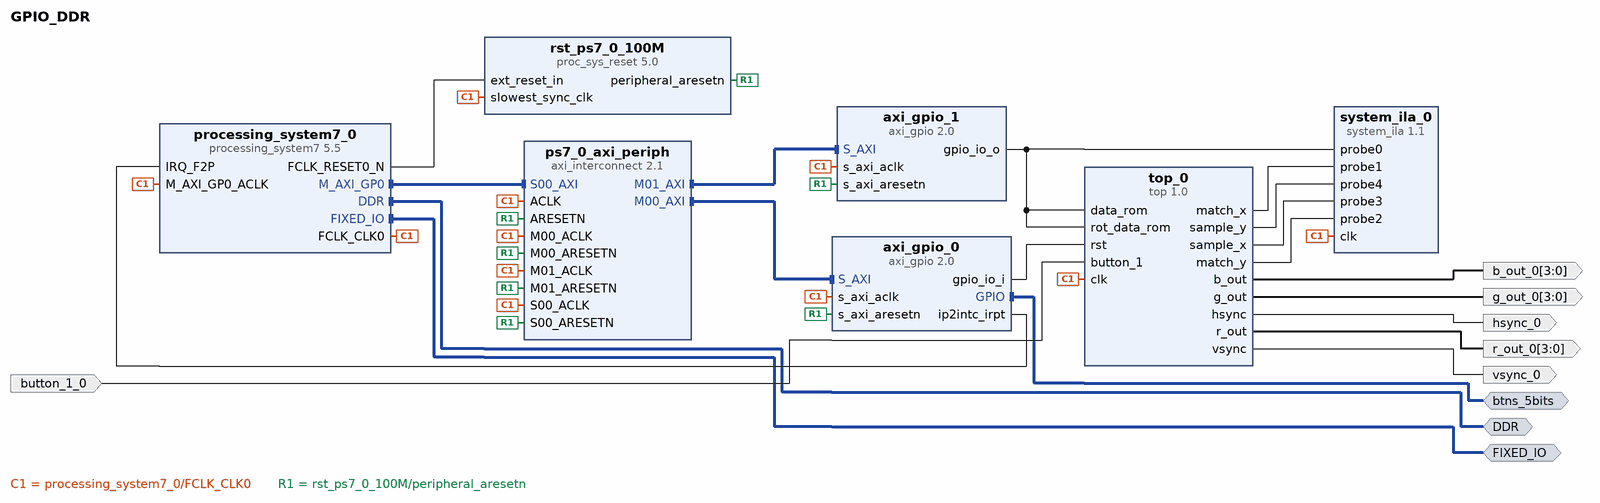
[diagram p0: block diagram of the top level]
# Vivado block design GPIO_DDR, xc7z020clg484-1, Vivado 2020.2
create_bd_design GPIO_DDR

create_bd_intf_port -mode Master -vlnv xilinx.com:interface:ddrx_rtl:1.0 DDR
create_bd_intf_port -mode Master -vlnv xilinx.com:display_processing_system7:fixedio_rtl:1.0 FIXED_IO
create_bd_intf_port -mode Master -vlnv xilinx.com:interface:gpio_rtl:1.0 btns_5bits
create_bd_port -dir I button_1_0
create_bd_port -dir O -from 3 -to 0 b_out_0
create_bd_port -dir O -from 3 -to 0 g_out_0
create_bd_port -dir O hsync_0
create_bd_port -dir O -from 3 -to 0 r_out_0
create_bd_port -dir O vsync_0

create_bd_cell -type ip -vlnv xilinx.com:ip:processing_system7:5.5 processing_system7_0
set_property -dict [list \
  CONFIG.PCW_APU_PERIPHERAL_FREQMHZ 666.666667 \
  CONFIG.PCW_ENET0_PERIPHERAL_ENABLE 0 \
  CONFIG.PCW_FPGA0_PERIPHERAL_FREQMHZ 100.000000 \
  CONFIG.PCW_FPGA1_PERIPHERAL_FREQMHZ 150.000000 \
  CONFIG.PCW_GPIO_MIO_GPIO_ENABLE 0 \
  CONFIG.PCW_IRQ_F2P_INTR 1 \
  CONFIG.PCW_PRESET_BANK1_VOLTAGE {LVCMOS 1.8V} \
  CONFIG.PCW_QSPI_PERIPHERAL_ENABLE 0 \
  CONFIG.PCW_SD0_GRP_CD_ENABLE 1 \
  CONFIG.PCW_SD0_GRP_CD_IO {MIO 47} \
  CONFIG.PCW_SD0_GRP_WP_ENABLE 1 \
  CONFIG.PCW_SD0_GRP_WP_IO {MIO 46} \
  CONFIG.PCW_SD0_PERIPHERAL_ENABLE 1 \
  CONFIG.PCW_SD0_SD0_IO {MIO 40 .. 45} \
  CONFIG.PCW_SDIO_PERIPHERAL_FREQMHZ 50 \
  CONFIG.PCW_UART1_PERIPHERAL_ENABLE 1 \
  CONFIG.PCW_UART1_UART1_IO {MIO 48 .. 49} \
  CONFIG.PCW_UART_PERIPHERAL_FREQMHZ 50 \
  CONFIG.PCW_UIPARAM_DDR_FREQ_MHZ 533.333313 \
  CONFIG.PCW_UIPARAM_DDR_PARTNO {MT41J128M16 HA-15E} \
  CONFIG.PCW_USB0_PERIPHERAL_ENABLE 0 \
  CONFIG.PCW_USE_FABRIC_INTERRUPT 1 \
  CONFIG.preset ZedBoard \
] [get_bd_cells processing_system7_0]
# 97 more settings of processing_system7_0 are not shown: defaults, MIO pin electricals, DDR timing, and values the tool derives
create_bd_cell -type ip -vlnv xilinx.com:ip:axi_gpio:2.0 axi_gpio_0
set_property -dict [list \
  CONFIG.C_GPIO_WIDTH 5 \
  CONFIG.C_INTERRUPT_PRESENT 1 \
  CONFIG.GPIO_BOARD_INTERFACE Custom \
  CONFIG.USE_BOARD_FLOW true \
] [get_bd_cells axi_gpio_0]
create_bd_cell -type ip -vlnv xilinx.com:ip:axi_interconnect:2.1 ps7_0_axi_periph
set_property -dict {CONFIG.NUM_MI 2} [get_bd_cells ps7_0_axi_periph]
create_bd_cell -type ip -vlnv xilinx.com:ip:proc_sys_reset:5.0 rst_ps7_0_100M
create_bd_cell -type ip -vlnv xilinx.com:ip:axi_gpio:2.0 axi_gpio_1
set_property -dict [list \
  CONFIG.C_ALL_OUTPUTS 1 \
  CONFIG.C_GPIO_WIDTH 8 \
  CONFIG.GPIO_BOARD_INTERFACE Custom \
  CONFIG.USE_BOARD_FLOW true \
] [get_bd_cells axi_gpio_1]
create_bd_cell -type ip -vlnv xilinx.com:user:top:1.0 top_0
create_bd_cell -type ip -vlnv xilinx.com:ip:system_ila:1.1 system_ila_0
set_property -dict [list \
  CONFIG.C_MON_TYPE NATIVE \
  CONFIG.C_NUM_OF_PROBES 5 \
  CONFIG.C_PROBE0_TYPE 0 \
  CONFIG.C_PROBE1_TYPE 0 \
  CONFIG.C_PROBE2_TYPE 0 \
  CONFIG.C_PROBE3_TYPE 0 \
  CONFIG.C_PROBE4_TYPE 0 \
] [get_bd_cells system_ila_0]

# ---- connections ----

connect_bd_intf_net [get_bd_intf_ports DDR] [get_bd_intf_pins processing_system7_0/DDR]
connect_bd_intf_net [get_bd_intf_ports btns_5bits] [get_bd_intf_pins axi_gpio_0/GPIO]
connect_bd_intf_net [get_bd_intf_pins processing_system7_0/M_AXI_GP0] [get_bd_intf_pins ps7_0_axi_periph/S00_AXI]
connect_bd_intf_net [get_bd_intf_pins ps7_0_axi_periph/M01_AXI] [get_bd_intf_pins axi_gpio_1/S_AXI]
connect_bd_intf_net [get_bd_intf_pins ps7_0_axi_periph/M00_AXI] [get_bd_intf_pins axi_gpio_0/S_AXI]
connect_bd_intf_net [get_bd_intf_ports FIXED_IO] [get_bd_intf_pins processing_system7_0/FIXED_IO]
connect_bd_net [get_bd_pins processing_system7_0/FCLK_CLK0] \
  [get_bd_pins processing_system7_0/M_AXI_GP0_ACLK] [get_bd_pins ps7_0_axi_periph/S00_ACLK] \
  [get_bd_pins rst_ps7_0_100M/slowest_sync_clk] [get_bd_pins axi_gpio_0/s_axi_aclk] [get_bd_pins ps7_0_axi_periph/M00_ACLK] \
  [get_bd_pins ps7_0_axi_periph/ACLK] [get_bd_pins axi_gpio_1/s_axi_aclk] [get_bd_pins ps7_0_axi_periph/M01_ACLK] \
  [get_bd_pins top_0/clk] [get_bd_pins system_ila_0/clk]
connect_bd_net [get_bd_pins processing_system7_0/FCLK_RESET0_N] [get_bd_pins rst_ps7_0_100M/ext_reset_in]
connect_bd_net [get_bd_pins rst_ps7_0_100M/peripheral_aresetn] \
  [get_bd_pins ps7_0_axi_periph/S00_ARESETN] [get_bd_pins axi_gpio_0/s_axi_aresetn] \
  [get_bd_pins ps7_0_axi_periph/M00_ARESETN] [get_bd_pins ps7_0_axi_periph/ARESETN] [get_bd_pins axi_gpio_1/s_axi_aresetn] \
  [get_bd_pins ps7_0_axi_periph/M01_ARESETN]
connect_bd_net [get_bd_pins axi_gpio_0/ip2intc_irpt] [get_bd_pins processing_system7_0/IRQ_F2P]
connect_bd_net -net axi_gpio_1_gpio_io_o [get_bd_pins axi_gpio_1/gpio_io_o] \
  [get_bd_pins top_0/data_rom] [get_bd_pins top_0/rot_data_rom] [get_bd_pins system_ila_0/probe0]
connect_bd_net -net button_1_0_1 [get_bd_ports button_1_0] [get_bd_pins top_0/button_1]
connect_bd_net -net match_x [get_bd_pins top_0/match_x] [get_bd_pins system_ila_0/probe1]
connect_bd_net -net sample_y [get_bd_pins top_0/sample_y] [get_bd_pins system_ila_0/probe4]
connect_bd_net -net sample_x [get_bd_pins top_0/sample_x] [get_bd_pins system_ila_0/probe3]
connect_bd_net -net match_y [get_bd_pins top_0/match_y] [get_bd_pins system_ila_0/probe2]
connect_bd_net [get_bd_pins top_0/b_out] [get_bd_ports b_out_0]
connect_bd_net [get_bd_pins top_0/g_out] [get_bd_ports g_out_0]
connect_bd_net [get_bd_pins top_0/hsync] [get_bd_ports hsync_0]
connect_bd_net [get_bd_pins top_0/r_out] [get_bd_ports r_out_0]
connect_bd_net [get_bd_pins top_0/vsync] [get_bd_ports vsync_0]
connect_bd_net [get_bd_pins axi_gpio_0/gpio_io_i] [get_bd_pins top_0/rst]
set_property HDL_ATTRIBUTE.DEBUG true [get_bd_nets axi_gpio_1_gpio_io_o]
set_property HDL_ATTRIBUTE.MARK_DEBUG true [get_bd_nets axi_gpio_1_gpio_io_o]
set_property HDL_ATTRIBUTE.DEBUG true [get_bd_nets match_x]
set_property HDL_ATTRIBUTE.MARK_DEBUG true [get_bd_nets match_x]
set_property HDL_ATTRIBUTE.DEBUG true [get_bd_nets sample_y]
set_property HDL_ATTRIBUTE.MARK_DEBUG true [get_bd_nets sample_y]
set_property HDL_ATTRIBUTE.DEBUG true [get_bd_nets sample_x]
set_property HDL_ATTRIBUTE.MARK_DEBUG true [get_bd_nets sample_x]
set_property HDL_ATTRIBUTE.DEBUG true [get_bd_nets match_y]
set_property HDL_ATTRIBUTE.MARK_DEBUG true [get_bd_nets match_y]

# ---- address map ----
assign_bd_address -offset 0x41200000 -range 64K -target_address_space [get_bd_addr_spaces processing_system7_0/Data] [get_bd_addr_segs axi_gpio_0/S_AXI/Reg]
assign_bd_address -offset 0x41210000 -range 64K -target_address_space [get_bd_addr_spaces processing_system7_0/Data] [get_bd_addr_segs axi_gpio_1/S_AXI/Reg]

validate_bd_design
save_bd_design
